# Altium schematic sheet Sheet4.SchDoc: Flight Computer Prototype
size A4; Organization: Altium Limited; Address1: L3, 12a Rodborough Rd; Address2: Frenchs Forest; Address3: NSW; Address4: Australia 2086; Revision: 1.0; SheetNumber: 4; SheetTotal: 4
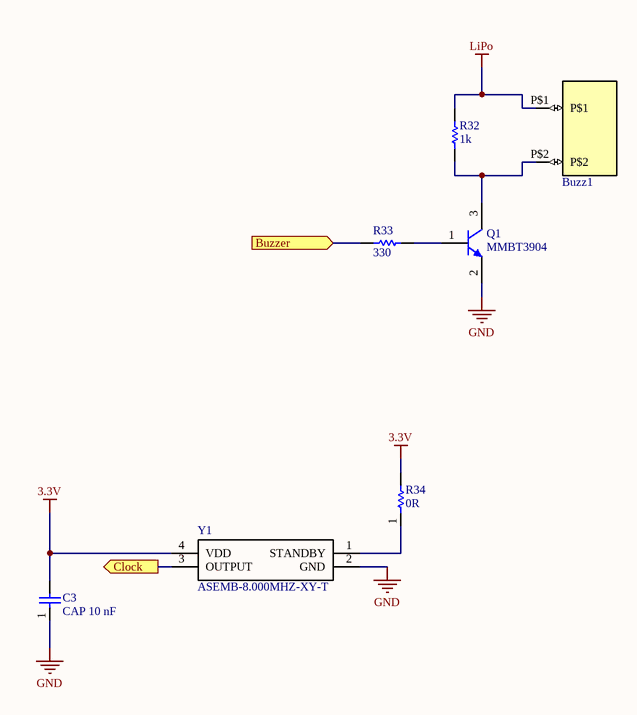
[diagram p0: Sheet4.SchDoc]

## Parts
Buzz1  PS1240P02BT  [*PS1240P02BT_PS1240P02BT(Primary)]  (value not drawn)
C3  CAP 10 nF  [06035C104KAT4A]
Q1  MMBT3904  [FAIR-SOT23-3_V]
R32  1k  [CR0603-J/-000ELF]
R33  330  [CR0603-J/-000ELF]
R34  0R  [CR0603-J/-000ELF]
Y1  ASEMB-8.000MHZ-XY-T  [ASEMB]

## Ports
Buzzer (in), Clock (out)

## Nets
3.3V: C3.2 R34.2 Y1.4(VDD)
GND: C3.1 Q1.2(E) Y1.2(GND)
LiPo: Buzz1.P$1 R32.2
Buzzer: R33.1 ; port Buzzer
Clock: Y1.3(OUTPUT) ; port Clock
NetBuzz1_P$2: Buzz1.P$2 Q1.3(C) R32.1
NetQ1_1: Q1.1(B) R33.2
NetR34_1: R34.1 Y1.1(STANDBY)

## Notes on the sheet
- Title
- UMSATS - Rocketry Division
- Designed By:
- Size:
- A4
- Number:
- 01
- Revision:
- Date:
- Time:
- Sheet
- of

## Library data of the parts
Buzz1 = PS1240P02BT: Audio Buzzer Piezo 30Vo-p 3Vo-p 70dBA Pin Through Hole T/R; MF: TDK; MP: PS1240P02BT; Price: None; Availability: Unavailable; Package: 2020 TDK; SnapEDA_Link: https://www.snapeda.com/parts/PS1240P02BT/TDK-Lambda%20Americas%20Inc/view-part/?ref=snap; Value: *
C3 = Cap: Capacitor; Published: 8-Jun-2000; LatestRevisionDate: 17-Jul-2002; LatestRevisionNote: Re-released for DXP Platform.; Publisher: Altium Limited
Q1 = CMP-1670-00008-1: NPN General Purpose Amplifier, 40 V, 0.2 A, -55 to 150 degC, 3-Pin SOT23, RoHS, Tape and Reel; Tolerance: 30ppm; Capacitance: 1.8E-11 f; Frequency: 12.288 MHz; ESR: 40 Ohm; Load Capacitance: 18 pF; REACH SVHC: No SVHC; Pins: 4; ComponentLink3URL: http://www.fairchildsemi.com/dwg/MA/MA03D.pdf; PackageDescription: 3-Pin Small Outline Transistor, Body 2.92 x 1.325 mm, Pitch 0.95 mm; ComponentLink1URL: https://www.fairchildsemi.com/; Max Operating Temperature: 70degC; PackageReference: SOT23-3; ComponentLink1Description: Manufacturer URL; Width: 0.126 inch; Min Operating Temperature: -20degC; DatasheetVersion: Rev. 1.1.0, 10/2014; Mount: Surface Mount; Height: 0.041 inch; Package Quantity: 1000; Frequency Tolerance: 30ppm; Packaging: Tape and Reel; ComponentLink2URL: https://www.fairchildsemi.com/datasheets/MM/MMBT3904.pdf; RoHSCompliant: True; ComponentLink3Description: Package Specification; ComponentLink2Description: Datasheet; Length: 0.197 inch
R32 = Res1: Resistor; Published: 8-Jun-2000; LatestRevisionDate: 17-Jul-2002; LatestRevisionNote: Re-released for DXP Platform.; PackageReference: AXIAL-0.3; Publisher: Altium Limited; PackageDescription: Axial Device, Thru-Hole; 2 Leads; 0.3 in Pin Spacing; Value: 1K
R33 R34 = Res1: Resistor; Value: 1K; Published: 8-Jun-2000; LatestRevisionDate: 17-Jul-2002; LatestRevisionNote: Re-released for DXP Platform.; PackageReference: AXIAL-0.3; Publisher: Altium Limited; PackageDescription: Axial Device, Thru-Hole; 2 Leads; 0.3 in Pin Spacing
Y1 = ASEMB-8.000MHZ-XY-T: Crystal or Oscillator; Manufacturer_Name: ABRACON; Datasheet Link: https://abracon.com/Oscillators/ASEMB.pdf; Manufacturer_Part_Number: ASEMB-8.000MHZ-XY-T; Mouser Part Number: 815-ASEMB-8-XY-T; Mouser Price/Stock: https://www.mouser.com/Search/Refine.aspx?Keyword=815-ASEMB-8-XY-T